# Altium schematic sheet Sheet1.SchDoc
size A4; SheetNumber: 1; SheetTotal: 1; SPICEModelCacheXMWDKLAO: <root> / <DocumentId>XMWDKLAO</DocumentId> / <CacheFrame Number="0"> / <Model Name="dıode" Kind="MDL"> / <Text>*Default Diode / *Diode Pinout: A,K / .MODEL DIODE D()</Text> / </Model> / <Model Name="1n4007" Kind="MDL"> / <Text>*1N4007 MCE 8-16-95 / *1000V 1A Si GenPurpose Diode pkg:DIODE0.4 1,2 / .MODEL 1N4007 D(IS=2.55E-9 RS=0.042 N=1.75 TT=5.76E-6 CJO=1.85E-11 / + VJ=0.75 M=0.333 BV=1000 IBV=9.86E-5 )</Text> / </Model> / </CacheFrame> / </root>
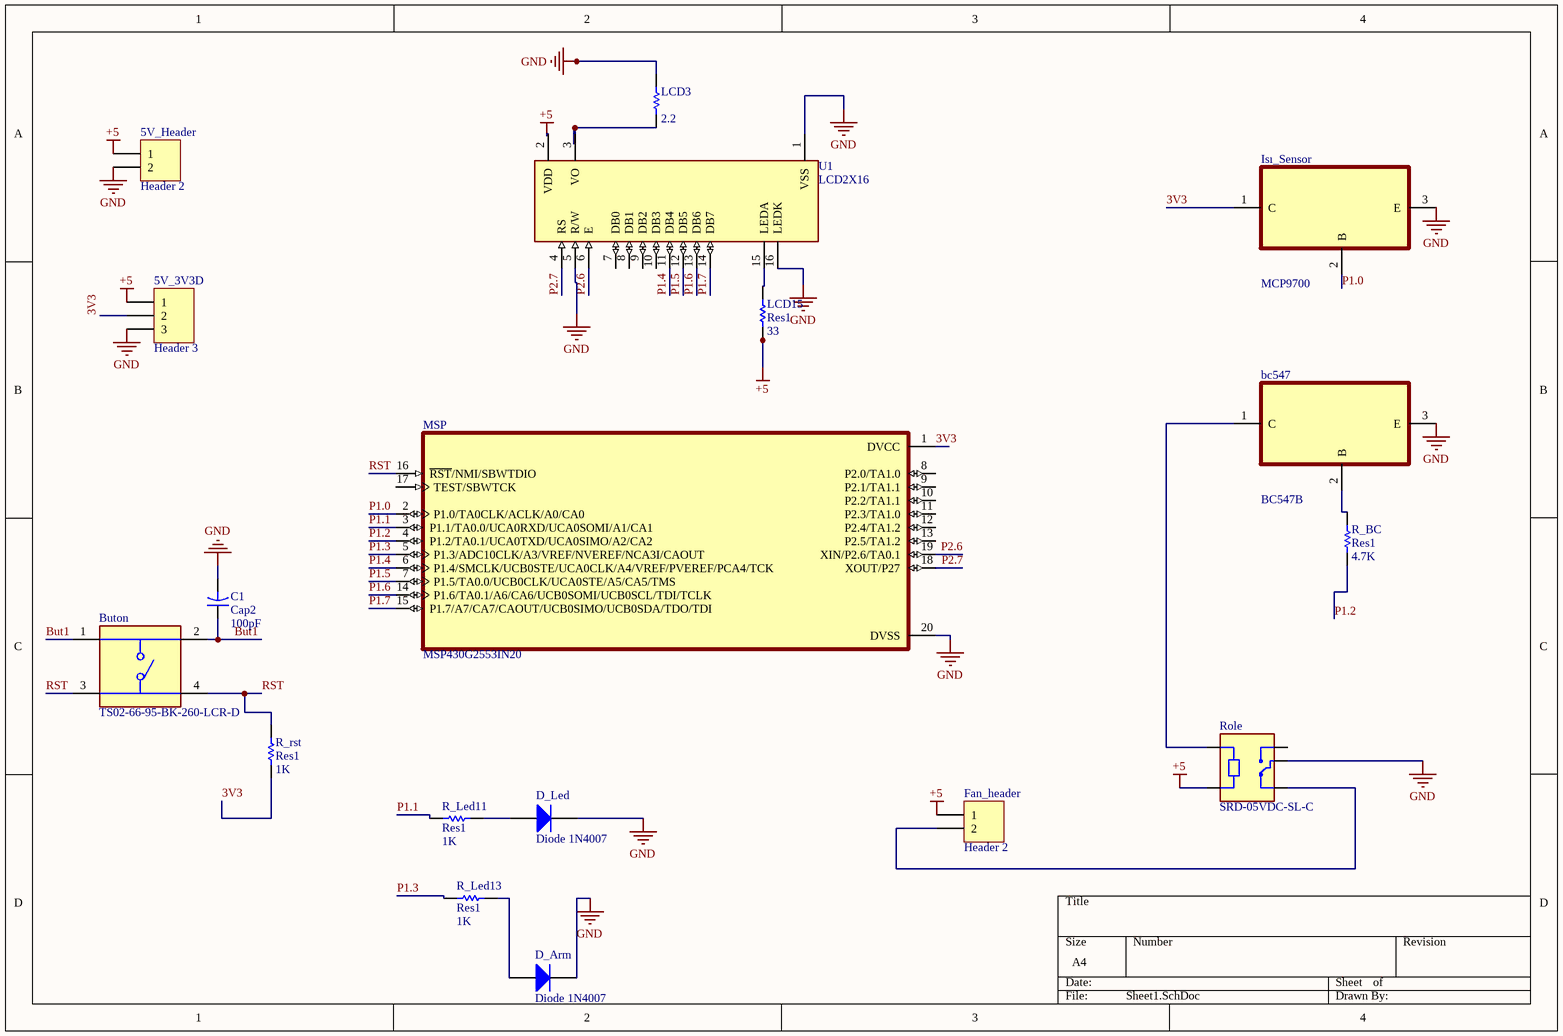
[diagram p0: Sheet1.SchDoc]

## Parts
5V_3V3D  Header 3  [HDR1X3]
5V_Header  Header 2  [HDR1X2]
bc547  BC547B  [TO127P254X732-3]
Buton  TS02-66-95-BK-260-LCR-D  [SW_TS02-66-95-BK-260-LCR-D]
C1  Cap2  value 100pF  [CAPR5-4X5]
D_Arm  Diode 1N4007  [DO-41]
D_Led  Diode 1N4007  [DO-41]
Fan_header  Header 2  [HDR1X2]
Isı_Sensor  MCP9700  [TO127P254X732-3]
LCD3  value 2.2  [AXIAL-0.3]
LCD15  Res1  value 33  [AXIAL-0.3]
MSP  MSP430G2553IN20  [DIP794W45P254L2692H508Q20]
R_BC  Res1  value 4.7K  [AXIAL-0.3]
R_Led11  Res1  value 1K  [AXIAL-0.3]
R_Led13  Res1  value 1K  [AXIAL-0.3]
R_rst  Res1  value 1K  [AXIAL-0.3]
Role  SRD-05VDC-SL-C  [RELAY_SRD-05VDC-SL-C]
U1  LCD2X16  [LCD_LCD2X16]

## Nets
+5: 5V_3V3D.1 5V_Header.1 Fan_header.1 LCD15.2 Role.A2 U1.2(VDD)
GND: 5V_3V3D.3 5V_Header.2 bc547.3(E) C1.2 D_Arm.2(K) D_Led.2(K) Isı_Sensor.3(E) LCD3.1 MSP.20(DVSS) Role.COM U1.1(VSS) U1.5(R/W) U1.16(LEDK)
3V3: 5V_3V3D.2 Isı_Sensor.1(C) MSP.1(DVCC) R_rst.2
But1: Buton.1 Buton.2 C1.1
P1.0: Isı_Sensor.2(B) MSP.2(P1.0/TA0CLK/ACLK/A0/CA0)
P1.1: MSP.3(P1.1/TA0.0/UCA0RXD/UCA0SOMI/A1/CA1) R_Led11.1
P1.2: MSP.4(P1.2/TA0.1/UCA0TXD/UCA0SIMO/A2/CA2) R_BC.2
P1.3: MSP.5(P1.3/ADC10CLK/A3/VREF/NVEREF/NCA3I/CAOUT) R_Led13.1
P1.4: MSP.6(P1.4/SMCLK/UCB0STE/UCA0CLK/A4/VREF/PVEREF/PCA4/TCK) U1.11(DB4)
P1.5: MSP.7(P1.5/TA0.0/UCB0CLK/UCA0STE/A5/CA5/TMS) U1.12(DB5)
P1.6: MSP.14(P1.6/TA0.1/A6/CA6/UCB0SOMI/UCB0SCL/TDI/TCLK) U1.13(DB6)
P1.7: MSP.15(P1.7/A7/CA7/CAOUT/UCB0SIMO/UCB0SDA/TDO/TDI) U1.14(DB7)
P2.6: MSP.19(XIN/P2.6/TA0.1) U1.6(E)
P2.7: MSP.18(XOUT/P27) U1.4(RS)
RST: Buton.3 Buton.4 MSP.16(~{RST}/NMI/SBWTDIO) R_rst.1
Netbc547_1: bc547.1(C) Role.A1
Netbc547_2: bc547.2(B) R_BC.1
NetD_Arm_1: D_Arm.1(A) R_Led13.2
NetD_Led_1: D_Led.1(A) R_Led11.2
NetFan_header_2: Fan_header.2 Role.NC
NetLCD3_2: LCD3.2 U1.3(VO)
NetLCD15_1: LCD15.1 U1.15(LEDA)

Not connected (* = marked no-connect by the designer): MSP 8(P2.0/TA1.0) 9(P2.1/TA1.1) 10(P2.2/TA1.1) 11(P2.3/TA1.0) 12(P2.4/TA1.2) 13(P2.5/TA1.2) 17(TEST/SBWTCK); Role NO; U1 7(DB0) 8(DB1) 9(DB2) 10(DB3)

## Library data of the parts
5V_3V3D = Header 3: Header, 3-Pin; LatestRevisionDate: 17-Jul-2002; LatestRevisionNote: Re-released for DXP Platform.; Publisher: Altium Limited
5V_Header Fan_header = Header 2: Header, 2-Pin; LatestRevisionDate: 17-Jul-2002; LatestRevisionNote: Re-released for DXP Platform.; Publisher: Altium Limited
bc547 Isı_Sensor = BC547B: NPN Epitaxial Silicon Transistor; MF: {'manufacturer': u'ON Semiconductor'}; Package: None; Price: None; Value: *; MP: BC547B; Availability: Unavailable
Buton = TS02-66-95-BK-260-LCR-D: MF: {'manufacturer': u'CUI Devices'}; Package: None; Price: None; Value: *; MP: TS02-66-95-BK-260-LCR-D; Availability: Unavailable
C1 = Cap2: Capacitor; Published: 23-Sep-2002; PackageReference: CAPR5-4X5; Publisher: Altium Limited; PackageDescription: Capacitor; 2 Leads
D_Arm D_Led = Diode 1N4007: 1 Amp General Purpose Rectifier; Published: 8-Jun-2000; LatestRevisionDate: 17-Jul-2002; LatestRevisionNote: Re-released for DXP Platform.; DatasheetVersion: 1998; PackageVersion: Aug-1999; PackageReference: DO-41; Publisher: Altium Limited; PackageDescription: Diode, Axial; Body 5.2 x 2.7 mm (LxDia. max), Lead Dia. 0.86 mm (max); Code_JEDEC: DO-204-AL; ComponentLink1Description: Manufacturer Link; ComponentLink1URL: http://www.fairchildsemi.com/; ComponentLink2Description: Datasheet; ComponentLink2URL: http://www.fairchildsemi.com/ds/1N%2F1N4001.pdf
LCD3 LCD15 R_BC R_Led11 R_Led13 R_rst = Res1: Resistor; Published: 8-Jun-2000; LatestRevisionDate: 17-Jul-2002; LatestRevisionNote: Re-released for DXP Platform.; PackageReference: AXIAL-0.3; Publisher: Altium Limited; PackageDescription: Axial Device, Thru-Hole; 2 Leads; 0.3 in Pin Spacing
MSP = MSP430G2553IN20: MSP430G2x53, MSP430G2x13 Mixed Signal Microcontroller 20-PDIP -40 to 85; MF: {'manufacturer': u'Texas Instruments'}; Package: None; Price: None; Value: *; MP: MSP430G2553IN20; Availability: Unavailable
Role = SRD-05VDC-SL-C: 5V Trigger Relay Module For Arduino And Raspberry Pi 5V Trigger Relay Module For Arduino And Raspberry Pi; MF: {'manufacturer': u'Songle Relay'}; Package: None; Price: None; Value: *; MP: SRD-05VDC-SL-C; Availability: Unavailable
U1 = LCD2X16: Display; Display: LCD 2x16 characters (blue backlight); MF: {'manufacturer': u'mikroElektronika'}; Package: None; Price: None; Value: *; MP: LCD2X16; Availability: Unavailable